# EAGLE schematic DICO_v100 (EAGLE 6.6.0)
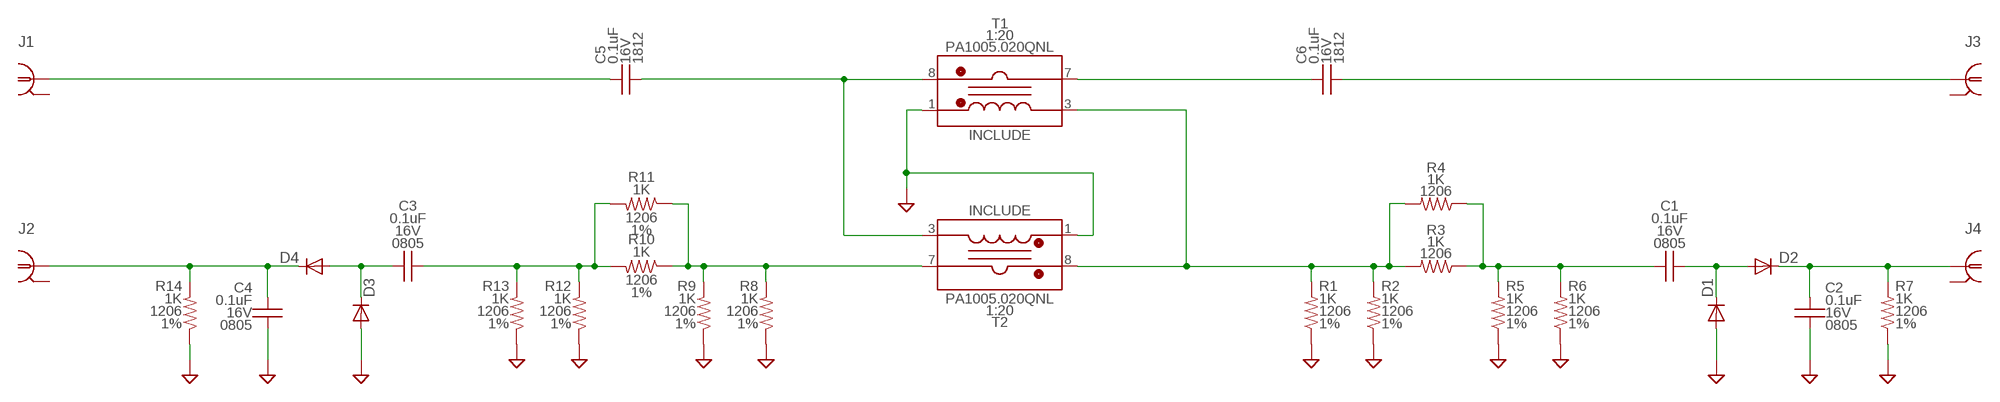
[diagram p0: schematic, sheet 1]

## Parts
C1  0.1uF  CC-0.1U-16V-0805-X7R0805_IPC  [0805_IPC-7351B]
C2  0.1uF  CC-0.1U-16V-0805-X7R0805_IPC  [0805_IPC-7351B]
C3  0.1uF  CC-0.1U-16V-0805-X7R0805_IPC  [0805_IPC-7351B]
C4  0.1uF  CC-0.1U-16V-0805-X7R0805_IPC  [0805_IPC-7351B]
C5  0.1uF  CC1812  [C1812]
C6  0.1uF  CC1812  [C1812]
D1  DIODE-SOD123  [SOD123]
D2  DIODE-SOD123  [SOD123]
D3  DIODE-SOD123  [SOD123]
D4  DIODE-SOD123  [SOD123]
J1  COAXBNC_EDGE  [BNC_EDGE]
J2  COAXBNC_EDGE  [BNC_EDGE]
J3  COAXBNC_EDGE  [BNC_EDGE]
J4  COAXBNC_EDGE  [BNC_EDGE]
R1  1K  RR-1.0K-1%-1206-0.25WR1206  [R1206]
R2  1K  RR-1.0K-1%-1206-0.25WR1206  [R1206]
R3  1K  RR-1.0K-1%-1206-0.25WR1206  [R1206]
R4  1K  RR-1.0K-1%-1206-0.25WR1206  [R1206]
R5  1K  RR-1.0K-1%-1206-0.25WR1206  [R1206]
R6  1K  RR-1.0K-1%-1206-0.25WR1206  [R1206]
R7  1K  RR-1.0K-1%-1206-0.25WR1206  [R1206]
R8  1K  RR-1.0K-1%-1206-0.25WR1206  [R1206]
R9  1K  RR-1.0K-1%-1206-0.25WR1206  [R1206]
R10  1K  R90R-1.0K-1%-1206-0.25WR1206  [R1206]
R11  1K  R90R-1.0K-1%-1206-0.25WR1206  [R1206]
R12  1K  RR-1.0K-1%-1206-0.25WR1206  [R1206]
R13  1K  RR-1.0K-1%-1206-0.25WR1206  [R1206]
R14  1K  RR-1.0K-1%-1206-0.25WR1206  [R1206]
T1  TRAFO_CURRENTSENSEPA1005.020QNLPA1005  [PA1005]
T2  TRAFO_CURRENTSENSEPA1005.020QNLPA1005  [PA1005]

## Nets
GND: C2.2 C4.2 D1.A D3.A R1.2 R2.2 R5.2 R6.2 R7.2 R8.2 R9.2 R12.2 R13.2 R14.2 T1.1(SS) T2.1(SS)
N$1: R1.1 R2.1 R3.1 R4.1 T1.3(SF) T2.8(PS)
N$2: C5.2 T1.8(PS) T2.3(SF)
N$3: C6.1 T1.7(PF)
N$4: C5.1 J1.C
N$5: C1.1 R3.2 R4.2 R5.1 R6.1
N$6: C1.2 D1.C D2.A
N$7: C2.1 D2.C J4.C R7.1
N$8: R8.1 R9.1 R10.1 R11.1 T2.7(PF)
N$9: C3.1 R10.2 R11.2 R12.1 R13.1
N$10: C3.2 D3.C D4.A
N$11: C4.1 D4.C J2.C R14.1
N$12: C6.2 J3.C

## Power pins joined to a net without a drawn wire
GND1: J1.G1(GND1) J1.G2(GND1) J1.G3(GND1) J1.G4(GND1) J2.G1(GND1) J2.G2(GND1) J2.G3(GND1) J2.G4(GND1) J3.G1(GND1) J3.G2(GND1) J3.G3(GND1) J3.G4(GND1) J4.G1(GND1) J4.G2(GND1) J4.G3(GND1) J4.G4(GND1)

## Library data of the parts
C1-C4 = MDT_C:C; PACKAGE: 0805; VOLTAGE: 16V
C5 C6 = MDT_C:C; PACKAGE: 1812; VOLTAGE: 16V
D1-D4 = diode:DIODE-: DIODE
J1-J4 = MDT_CON:COAX
R1-R9 R12-R14 = MDT_R:R; PACKAGE: 1206; POWER: 0.25; TOL: 1%
R10 R11 = MDT_R:R90; PACKAGE: 1206; POWER: 0.25; TOL: 1%
T1 T2 = MDT_TRAFO:TRAFO_CURRENTSENSE; BOM: INCLUDE; PACKAGE: SMD; PARTNO: PA1005.020QNL; RATIO: 1:20